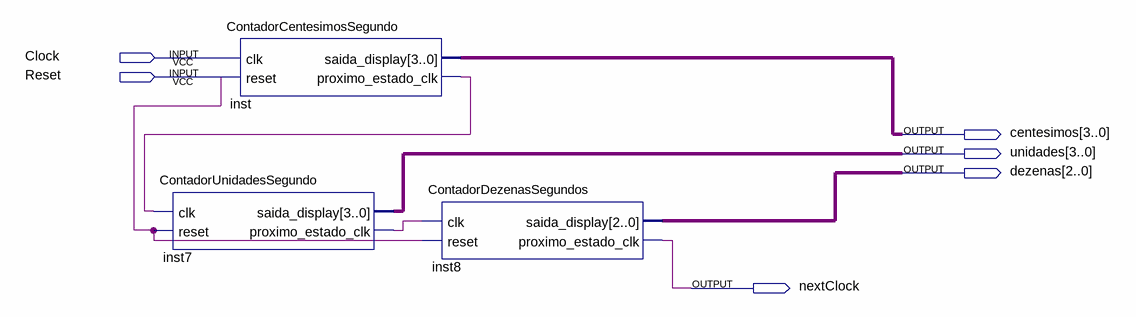
[diagram p0: schematic sheet]
// Quartus schematic relogio.bdf as structural Verilog: 3 symbols, 6 pins
module relogio (
  input  Clock,
  input  Reset,
  output [3:0] centesimos,
  output [3:0] unidades,
  output [2:0] dezenas,
  output nextClock
);

  wire inst7_proximo_estado_clk, inst_proximo_estado_clk;

  ContadorUnidadesSegundo inst7 (
    .clk(inst_proximo_estado_clk), .reset(Reset), .saida_display(unidades),
    .proximo_estado_clk(inst7_proximo_estado_clk));
  ContadorCentesimosSegundo inst (
    .clk(Clock), .reset(Reset), .saida_display(centesimos), .proximo_estado_clk(inst_proximo_estado_clk));
  ContadorDezenasSegundos inst8 (
    .clk(inst7_proximo_estado_clk), .reset(Reset), .saida_display(dezenas), .proximo_estado_clk(nextClock));
endmodule
